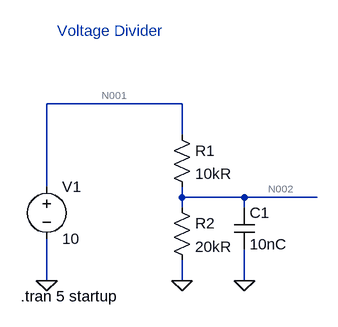
[diagram p0: schematic Draft3.asc]
Draft3.asc, the LTspice schematic file:
Version 4.1
SHEET 1 880 680
WIRE 272 0 64 0
WIRE 272 48 272 0
WIRE 64 128 64 0
WIRE 272 144 272 128
WIRE 368 144 272 144
WIRE 480 144 368 144
WIRE 272 160 272 144
WIRE 368 160 368 144
WIRE 64 272 64 208
WIRE 272 272 272 240
WIRE 368 272 368 224
FLAG 64 272 0
FLAG 272 272 0
FLAG 368 272 0
SYMBOL voltage 64 112 R0
WINDOW 123 0 0 Left 0
WINDOW 39 0 0 Left 0
SYMATTR InstName V1
SYMATTR Value 10
SYMBOL res 256 32 R0
SYMATTR InstName R1
SYMATTR Value 10kR
SYMBOL res 256 144 R0
SYMATTR InstName R2
SYMATTR Value 20kR
SYMBOL cap 352 160 R0
SYMATTR InstName C1
SYMATTR Value 10nC
TEXT 80 -112 Left 2 ;Voltage Divider
TEXT 24 296 Left 2 !.tran 5 startup

The netlist it stands for:
* Draft3.asc
V1 N001 0 10
R1 N001 N002 10kR
R2 N002 0 20kR
C1 N002 0 10nC
* Voltage Divider
.tran 5 startup
.backanno
.end

* Results of the author's LTspice run, read from the files saved beside the schematic
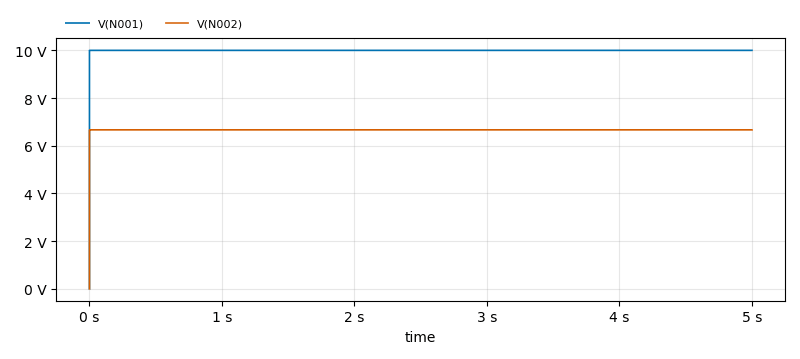
[diagram p1: Transient Analysis of Draft3.asc, plotted from the saved traces]
* Transient Analysis, 1 run:
*   V(N001): min 0 V, max 10 V, average 10 V, rms 10 V, last 10 V
*   V(N002): min 0 V, max 6.667 V, average 6.667 V, rms 6.667 V, last 6.667 V